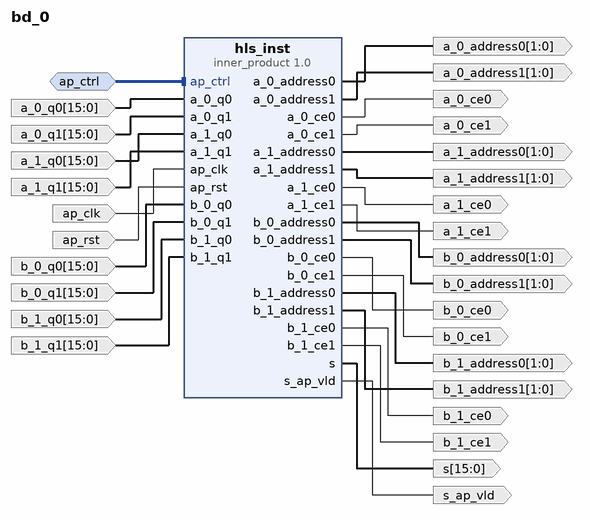
[diagram p0: block diagram of the top level]
# Vivado block design bd_0, xc7k160tfbg676-2, Vivado 2022.1
create_bd_design bd_0

create_bd_intf_port -mode Slave -vlnv xilinx.com:interface:acc_handshake_rtl:1.0 ap_ctrl
create_bd_port -dir O -from 1 -to 0 -type data a_0_address0
create_bd_port -dir O -from 1 -to 0 -type data a_0_address1
create_bd_port -dir O a_0_ce0
create_bd_port -dir O a_0_ce1
create_bd_port -dir I -from 15 -to 0 -type data a_0_q0
create_bd_port -dir I -from 15 -to 0 -type data a_0_q1
create_bd_port -dir O -from 1 -to 0 -type data a_1_address0
create_bd_port -dir O -from 1 -to 0 -type data a_1_address1
create_bd_port -dir O a_1_ce0
create_bd_port -dir O a_1_ce1
create_bd_port -dir I -from 15 -to 0 -type data a_1_q0
create_bd_port -dir I -from 15 -to 0 -type data a_1_q1
create_bd_port -dir I -type clk ap_clk
set_property -dict {CONFIG.FREQ_HZ 250000000.0} [get_bd_ports ap_clk]
create_bd_port -dir I -type rst ap_rst
set_property -dict {CONFIG.POLARITY ACTIVE_HIGH} [get_bd_ports ap_rst]
create_bd_port -dir O -from 1 -to 0 -type data b_0_address0
create_bd_port -dir O -from 1 -to 0 -type data b_0_address1
create_bd_port -dir O b_0_ce0
create_bd_port -dir O b_0_ce1
create_bd_port -dir I -from 15 -to 0 -type data b_0_q0
create_bd_port -dir I -from 15 -to 0 -type data b_0_q1
create_bd_port -dir O -from 1 -to 0 -type data b_1_address0
create_bd_port -dir O -from 1 -to 0 -type data b_1_address1
create_bd_port -dir O b_1_ce0
create_bd_port -dir O b_1_ce1
create_bd_port -dir I -from 15 -to 0 -type data b_1_q0
create_bd_port -dir I -from 15 -to 0 -type data b_1_q1
create_bd_port -dir O -from 15 -to 0 -type data s
create_bd_port -dir O s_ap_vld

create_bd_cell -type ip -vlnv xilinx.com:hls:inner_product:1.0 hls_inst

# ---- connections ----

connect_bd_intf_net -intf_net ap_ctrl_0_1 [get_bd_intf_ports ap_ctrl] [get_bd_intf_pins hls_inst/ap_ctrl]
connect_bd_net -net a_0_q0_0_1 [get_bd_ports a_0_q0] [get_bd_pins hls_inst/a_0_q0]
connect_bd_net -net a_0_q1_0_1 [get_bd_ports a_0_q1] [get_bd_pins hls_inst/a_0_q1]
connect_bd_net -net a_1_q0_0_1 [get_bd_ports a_1_q0] [get_bd_pins hls_inst/a_1_q0]
connect_bd_net -net a_1_q1_0_1 [get_bd_ports a_1_q1] [get_bd_pins hls_inst/a_1_q1]
connect_bd_net -net ap_clk_0_1 [get_bd_ports ap_clk] [get_bd_pins hls_inst/ap_clk]
connect_bd_net -net ap_rst_0_1 [get_bd_ports ap_rst] [get_bd_pins hls_inst/ap_rst]
connect_bd_net -net b_0_q0_0_1 [get_bd_ports b_0_q0] [get_bd_pins hls_inst/b_0_q0]
connect_bd_net -net b_0_q1_0_1 [get_bd_ports b_0_q1] [get_bd_pins hls_inst/b_0_q1]
connect_bd_net -net b_1_q0_0_1 [get_bd_ports b_1_q0] [get_bd_pins hls_inst/b_1_q0]
connect_bd_net -net b_1_q1_0_1 [get_bd_ports b_1_q1] [get_bd_pins hls_inst/b_1_q1]
connect_bd_net [get_bd_pins hls_inst/a_0_address0] [get_bd_ports a_0_address0]
connect_bd_net [get_bd_pins hls_inst/a_0_address1] [get_bd_ports a_0_address1]
connect_bd_net [get_bd_pins hls_inst/a_0_ce0] [get_bd_ports a_0_ce0]
connect_bd_net [get_bd_pins hls_inst/a_0_ce1] [get_bd_ports a_0_ce1]
connect_bd_net [get_bd_pins hls_inst/a_1_address0] [get_bd_ports a_1_address0]
connect_bd_net [get_bd_pins hls_inst/a_1_address1] [get_bd_ports a_1_address1]
connect_bd_net [get_bd_pins hls_inst/a_1_ce0] [get_bd_ports a_1_ce0]
connect_bd_net [get_bd_pins hls_inst/a_1_ce1] [get_bd_ports a_1_ce1]
connect_bd_net [get_bd_pins hls_inst/b_0_address0] [get_bd_ports b_0_address0]
connect_bd_net [get_bd_pins hls_inst/b_0_address1] [get_bd_ports b_0_address1]
connect_bd_net [get_bd_pins hls_inst/b_0_ce0] [get_bd_ports b_0_ce0]
connect_bd_net [get_bd_pins hls_inst/b_0_ce1] [get_bd_ports b_0_ce1]
connect_bd_net [get_bd_pins hls_inst/b_1_address0] [get_bd_ports b_1_address0]
connect_bd_net [get_bd_pins hls_inst/b_1_address1] [get_bd_ports b_1_address1]
connect_bd_net [get_bd_pins hls_inst/b_1_ce0] [get_bd_ports b_1_ce0]
connect_bd_net [get_bd_pins hls_inst/b_1_ce1] [get_bd_ports b_1_ce1]
connect_bd_net [get_bd_pins hls_inst/s] [get_bd_ports s]
connect_bd_net [get_bd_pins hls_inst/s_ap_vld] [get_bd_ports s_ap_vld]

validate_bd_design
save_bd_design
